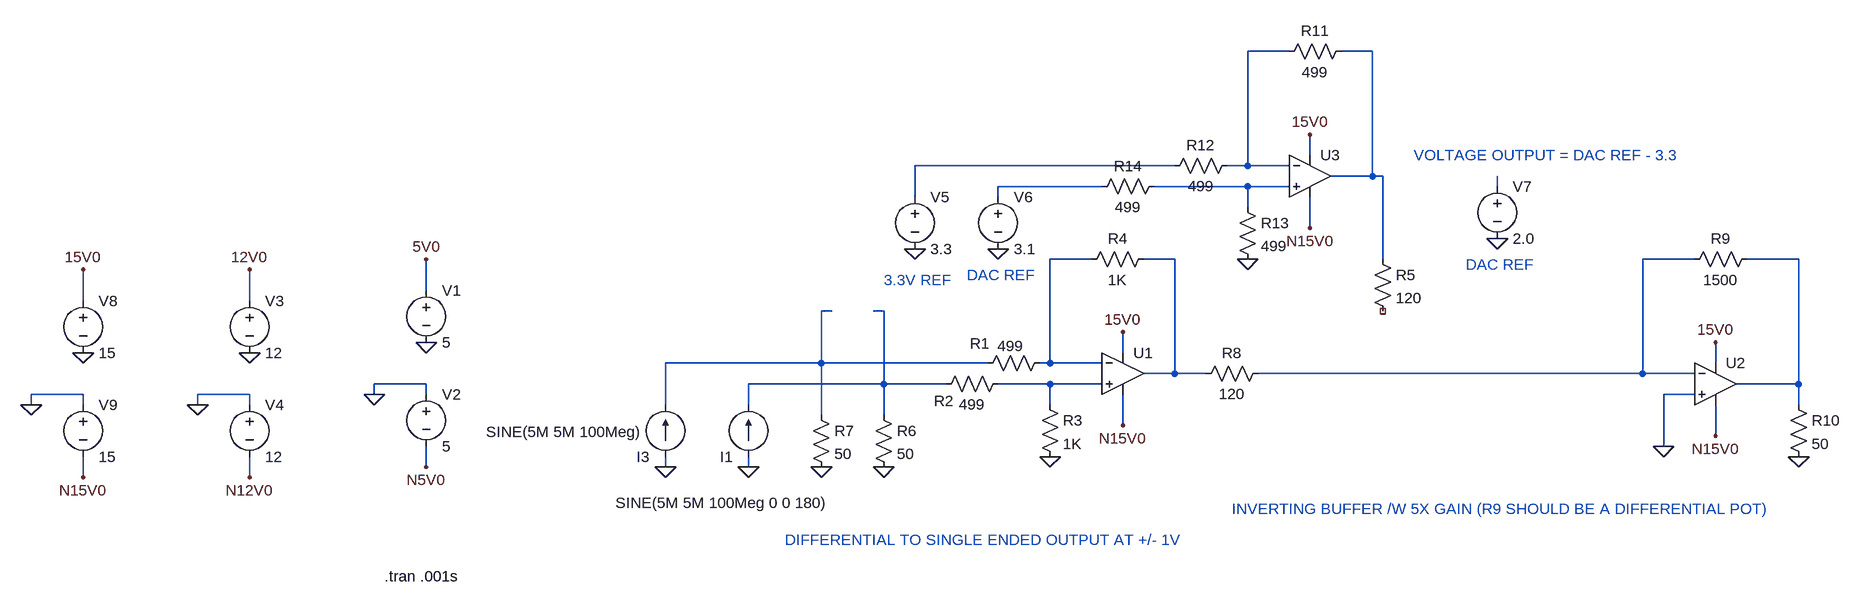
[diagram p0: schematic analog.asc]
analog.asc, the LTspice schematic file:
Version 4
SHEET 1 2916 680
WIRE 784 -416 720 -416
WIRE 912 -416 864 -416
WIRE 816 -256 816 -288
WIRE 608 -240 208 -240
WIRE 720 -240 720 -416
WIRE 720 -240 688 -240
WIRE 784 -240 720 -240
WIRE 912 -224 912 -416
WIRE 912 -224 848 -224
WIRE 928 -224 912 -224
WIRE 496 -208 336 -208
WIRE 720 -208 576 -208
WIRE 784 -208 720 -208
WIRE 1104 -208 1104 -224
WIRE 208 -192 208 -240
WIRE 336 -192 336 -208
WIRE 720 -176 720 -208
WIRE 816 -144 816 -192
WIRE 480 -96 416 -96
WIRE 608 -96 560 -96
WIRE 928 -96 928 -224
WIRE 1408 -96 1328 -96
WIRE 1568 -96 1488 -96
WIRE -544 -48 -544 -96
WIRE -1072 -32 -1072 -80
WIRE -816 -32 -816 -80
WIRE 80 -16 64 -16
WIRE 160 -16 144 -16
WIRE 528 48 528 16
WIRE 64 64 64 -16
WIRE 64 64 -176 64
WIRE 320 64 64 64
WIRE 416 64 416 -96
WIRE 416 64 400 64
WIRE 496 64 416 64
WIRE 1440 64 1440 32
WIRE 608 80 608 -96
WIRE 608 80 560 80
WIRE 656 80 608 80
WIRE 1328 80 1328 -96
WIRE 1328 80 736 80
WIRE 1408 80 1328 80
WIRE -544 96 -624 96
WIRE 160 96 160 -16
WIRE 160 96 -48 96
WIRE 256 96 160 96
WIRE 416 96 336 96
WIRE 496 96 416 96
WIRE 1568 96 1568 -96
WIRE 1568 96 1472 96
WIRE -1072 112 -1152 112
WIRE -816 112 -896 112
WIRE -624 112 -624 96
WIRE -544 112 -544 96
WIRE 1408 112 1360 112
WIRE -1152 128 -1152 112
WIRE -1072 128 -1072 112
WIRE -896 128 -896 112
WIRE -816 128 -816 112
WIRE -176 128 -176 64
WIRE -48 128 -48 96
WIRE 416 128 416 96
WIRE 1568 128 1568 96
WIRE 64 144 64 64
WIRE 160 144 160 96
WIRE 528 160 528 112
WIRE 1440 176 1440 128
WIRE 1360 192 1360 112
WIRE -544 224 -544 192
WIRE -176 224 -176 208
WIRE -48 224 -48 208
WIRE -1072 240 -1072 208
WIRE -816 240 -816 208
FLAG -544 32 0
FLAG -624 112 0
FLAG -544 224 N5V0
FLAG -544 -96 5V0
FLAG 528 16 15V0
FLAG -176 224 0
FLAG 416 208 0
FLAG -48 224 0
FLAG 160 224 0
FLAG 64 224 0
FLAG 1360 192 0
FLAG 1568 208 0
FLAG 1440 32 15V0
FLAG 528 160 N15V0
FLAG 1440 176 N15V0
FLAG -816 48 0
FLAG -896 128 0
FLAG -816 240 N12V0
FLAG -816 -80 12V0
FLAG 208 -112 0
FLAG 816 -288 15V0
FLAG 816 -144 N15V0
FLAG 720 -96 0
FLAG 336 -112 0
FLAG 1104 -128 0
FLAG -1072 48 0
FLAG -1152 128 0
FLAG -1072 240 N15V0
FLAG -1072 -80 15V0
SYMBOL voltage -544 -64 R0
WINDOW 123 0 0 Left 0
WINDOW 39 0 0 Left 0
SYMATTR InstName V1
SYMATTR Value 5
SYMBOL voltage -544 96 R0
WINDOW 123 0 0 Left 0
WINDOW 39 0 0 Left 0
SYMATTR InstName V2
SYMATTR Value 5
SYMBOL res 576 -112 R90
WINDOW 0 0 56 VBottom 2
WINDOW 3 32 56 VTop 2
SYMATTR InstName R4
SYMATTR Value 1K
SYMBOL current -176 208 R180
WINDOW 3 35 38 Left 2
WINDOW 123 0 0 Left 0
WINDOW 39 0 0 Left 0
SYMATTR Value SINE(5M 5M 100Meg)
SYMATTR InstName I3
SYMBOL res 416 48 R90
WINDOW 0 1 108 VBottom 2
WINDOW 3 -26 61 VTop 2
SYMATTR InstName R1
SYMATTR Value 499
SYMBOL res 352 80 R90
WINDOW 0 58 99 VBottom 2
WINDOW 3 32 56 VTop 2
SYMATTR InstName R2
SYMATTR Value 499
SYMBOL res 400 112 R0
SYMATTR InstName R3
SYMATTR Value 1K
SYMBOL current -48 208 R180
WINDOW 3 -124 -71 Left 2
WINDOW 123 0 0 Left 0
WINDOW 39 0 0 Left 0
SYMATTR Value SINE(5M 5M 100Meg 0 0 180)
SYMATTR InstName I1
SYMBOL res 144 128 R0
SYMATTR InstName R6
SYMATTR Value 50
SYMBOL res 48 128 R0
SYMATTR InstName R7
SYMATTR Value 50
SYMBOL res 752 64 R90
WINDOW 0 0 56 VBottom 2
WINDOW 3 32 56 VTop 2
SYMATTR InstName R8
SYMATTR Value 120
SYMBOL res 1504 -112 R90
WINDOW 0 0 56 VBottom 2
WINDOW 3 32 56 VTop 2
SYMATTR InstName R9
SYMATTR Value 1500
SYMBOL res 1552 112 R0
SYMATTR InstName R10
SYMATTR Value 50
SYMBOL OpAmps\\UniversalOpAmp2 528 80 R0
SYMATTR InstName U1
SYMATTR Value2 Avol=1Meg GBW=8000Meg Slew=8000Meg
SYMATTR SpiceLine Ilimit=50M Rail=0 Vos=0
SYMBOL OpAmps\\UniversalOpAmp2 1440 96 R0
SYMATTR InstName U2
SYMATTR Value2 Avol=1Meg GBW=8000Meg Slew=8000Meg
SYMATTR SpiceLine Ilimit=1 Rail=0 Vos=0
SYMBOL voltage -816 -48 R0
WINDOW 123 0 0 Left 0
WINDOW 39 0 0 Left 0
SYMATTR InstName V3
SYMATTR Value 12
SYMBOL voltage -816 112 R0
WINDOW 123 0 0 Left 0
WINDOW 39 0 0 Left 0
SYMATTR InstName V4
SYMATTR Value 12
SYMBOL res 912 -112 R0
SYMATTR InstName R5
SYMATTR Value 120
SYMBOL voltage 208 -208 R0
WINDOW 123 0 0 Left 0
WINDOW 39 0 0 Left 0
SYMATTR InstName V5
SYMATTR Value 3.3
SYMBOL OpAmps\\UniversalOpAmp2 816 -224 R0
SYMATTR InstName U3
SYMATTR Value2 Avol=1Meg GBW=8000Meg Slew=8000Meg
SYMATTR SpiceLine Ilimit=50M Rail=0 Vos=0
SYMBOL res 880 -432 R90
WINDOW 0 0 56 VBottom 2
WINDOW 3 32 56 VTop 2
SYMATTR InstName R11
SYMATTR Value 499
SYMBOL res 704 -256 R90
WINDOW 0 0 56 VBottom 2
WINDOW 3 32 56 VTop 2
SYMATTR InstName R12
SYMATTR Value 499
SYMBOL res 704 -192 R0
SYMATTR InstName R13
SYMATTR Value 499
SYMBOL res 592 -224 R90
WINDOW 0 0 56 VBottom 2
WINDOW 3 32 56 VTop 2
SYMATTR InstName R14
SYMATTR Value 499
SYMBOL voltage 336 -208 R0
WINDOW 123 0 0 Left 0
WINDOW 39 0 0 Left 0
SYMATTR InstName V6
SYMATTR Value 3.1
SYMBOL voltage 1104 -224 R0
WINDOW 123 0 0 Left 0
WINDOW 39 0 0 Left 0
SYMATTR InstName V7
SYMATTR Value 2.0
SYMBOL voltage -1072 -48 R0
WINDOW 123 0 0 Left 0
WINDOW 39 0 0 Left 0
SYMATTR InstName V8
SYMATTR Value 15
SYMBOL voltage -1072 112 R0
WINDOW 123 0 0 Left 0
WINDOW 39 0 0 Left 0
SYMATTR InstName V9
SYMATTR Value 15
TEXT -608 392 Left 2 !.tran .001s
TEXT 8 336 Left 2 ;DIFFERENTIAL TO SINGLE ENDED OUTPUT AT +/- 1V
TEXT 696 288 Left 2 ;INVERTING BUFFER /W 5X GAIN (R9 SHOULD BE A DIFFERENTIAL POT)
TEXT 160 -64 Left 2 ;3.3V REF
TEXT 288 -72 Left 2 ;DAC REF
TEXT 976 -256 Left 2 ;VOLTAGE OUTPUT = DAC REF - 3.3
TEXT 1056 -88 Left 2 ;DAC REF

The netlist it stands for:
* analog.asc
V1 5V0 0 5
V2 0 N5V0 5
R4 N008 N007 1K
I3 0 N011 SINE(5M 5M 100Meg)
R1 N007 N011 499
R2 N013 N012 499
R3 N013 0 1K
I1 0 N012 SINE(5M 5M 100Meg 0 0 180)
R6 N012 0 50
R7 N011 0 50
R8 N009 N008 120
R9 N010 N009 1500
R10 N010 0 50
XU1 N013 N007 15V0 N15V0 N008 level2 Avol=1Meg GBW=8000Meg Slew=8000Meg Ilimit=50M Rail=0 Vos=0 En=0 Enk=0 In=0 Ink=0 Rin=500Meg  ; pins In+ In- V+ V- OUT
XU2 0 N009 15V0 N15V0 N010 level2 Avol=1Meg GBW=8000Meg Slew=8000Meg Ilimit=1 Rail=0 Vos=0 En=0 Enk=0 In=0 Ink=0 Rin=500Meg  ; pins In+ In- V+ V- OUT
V3 12V0 0 12
V4 0 N12V0 12
R5 N002 NC_01 120
V5 N003 0 3.3
XU3 N005 N001 15V0 N15V0 N002 level2 Avol=1Meg GBW=8000Meg Slew=8000Meg Ilimit=50M Rail=0 Vos=0 En=0 Enk=0 In=0 Ink=0 Rin=500Meg  ; pins In+ In- V+ V- OUT
R11 N002 N001 499
R12 N001 N003 499
R13 N005 0 499
R14 N005 N004 499
V6 N004 0 3.1
V7 N006 0 2.0
V8 15V0 0 15
V9 0 N15V0 15
.tran .001s
* DIFFERENTIAL TO SINGLE ENDED OUTPUT AT +/- 1V
* INVERTING BUFFER /W 5X GAIN (R9 SHOULD BE A DIFFERENTIAL POT)
* 3.3V REF
* DAC REF
* VOLTAGE OUTPUT = DAC REF - 3.3
* DAC REF
.lib UniversalOpAmp2.lib
.backanno
.end